# EAGLE design Placa final para testes (EAGLE 9.6.2)
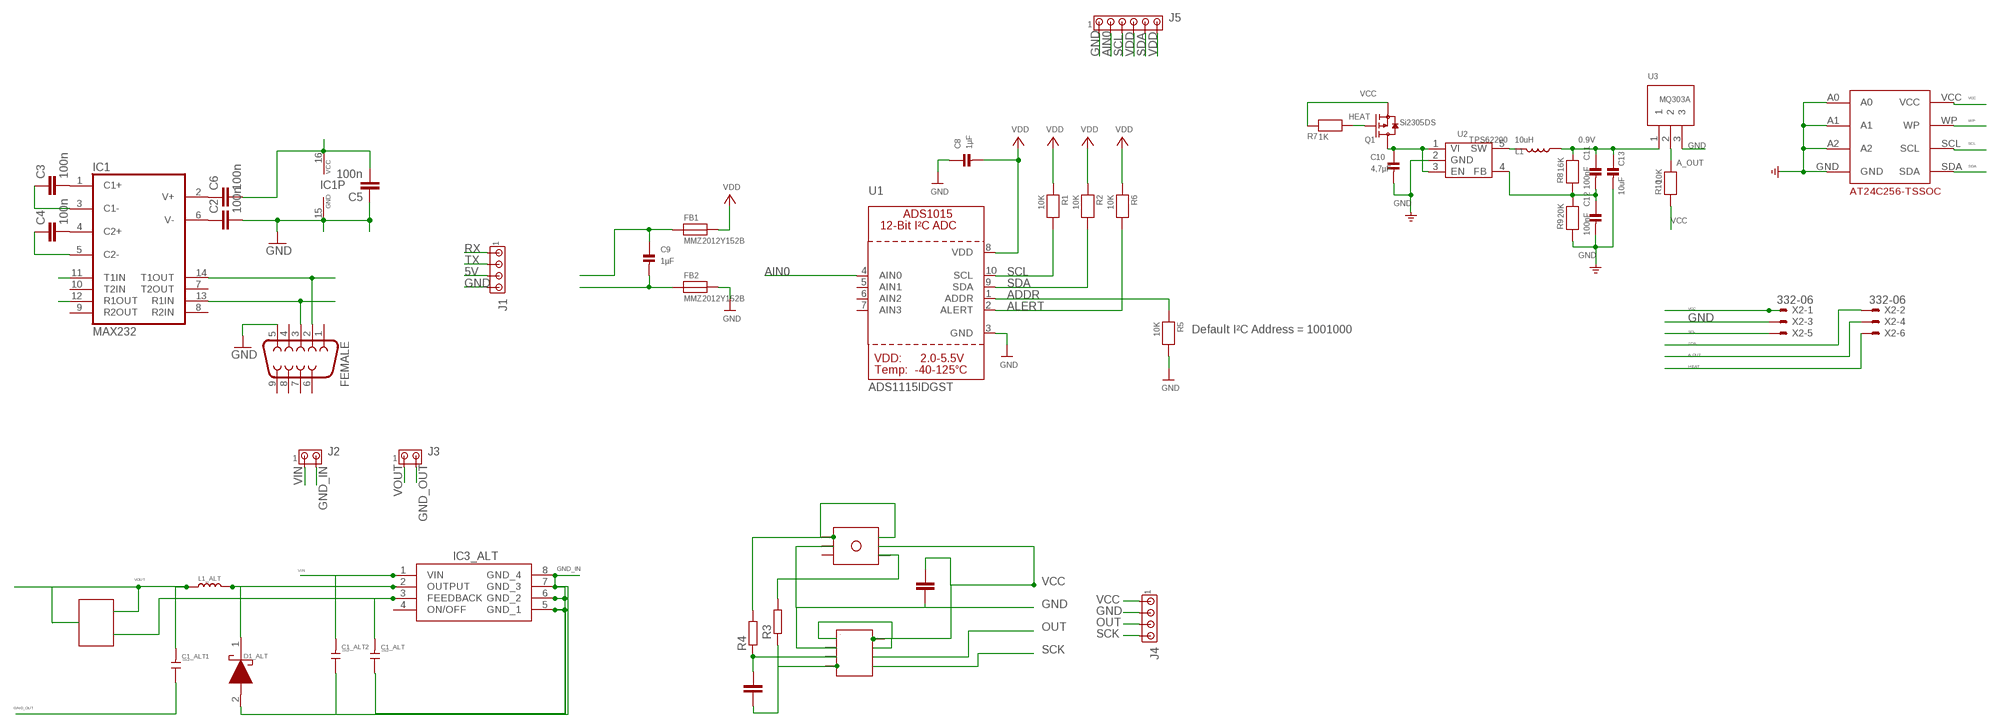
[diagram p0: schematic, sheet 1]

## Parts
C1  100n  C-EUC0805  [C0805]
C1_ALT  105uF  C-0805  [C0805]
C1_ALT1  105uF  C-0805  [C0805]
C1_ALT2  105uF  C-0805  [C0805]
C2  100n  C-EUC0805  [C0805]
C3  100n  C-EUC0805  [C0805]
C4  100n  C-EUC0805  [C0805]
C5  100n  C-EUC0805  [C0805]
C6  100n  C-EUC0805  [C0805]
C7  100n  C-EUC0805  [C0805]
C8  1µF  CAP_CERAMIC0805  [0805]
C9  1µF  CAP_CERAMIC0805  [0805]
C10  4,7µF  CAP_CERAMIC0805  [0805]
C11  100nF  CAP_CERAMIC0805  [0805]
C12  100nF  CAP_CERAMIC0805  [0805]
C13  10uF  CAP_CERAMIC0805  [0805]
D1_ALT  1N5819HW1-7-F  [SODFL3518X115N]
FB1  MMZ2012Y152B  FERRITE0805  [0805]
FB2  MMZ2012Y152B  FERRITE0805  [0805]
FEMALE  F09H  [F09H]
IC1  MAX232  MAX232ECWES  [SO16]
IC3_ALT  XL1509-3.3E1  [SOIC127P600X175-8N]
J1  MTA04-156  [1X4MTA]
J2  MTA02-156  [1X2MTA]
J3  MTA02-156  [1X2MTA]
J4  MTA04-100  [10X04MTA]
J5  MTA06-156  [1X6MTA]
L1  10uH  L'PIO73'  [PIO73]
L1_ALT  47uH  L'PIO73'  [PIO73]
Q1  Si2305DS  MOSFET-P'SI2323CDS/SI2305DS<BR>'  [SOT23]
R1  10K  RESISTOR0805  [0805]
R2  10K  RESISTOR0805  [0805]
R3  R-EU_R0805  [R0805]
R4  R-EU_R0805  [R0805]
R5  10K  RESISTOR0805  [0805]
R6  10K  RESISTOR0805  [0805]
R7  1K  RESISTOR0805  [0805]
R8  16K  RESISTOR0805  [0805]
R9  20K  RESISTOR0805  [0805]
R10  10K  RESISTOR0805  [0805]
U1  ADS1115IDGST  ADC_ADS1015  [MSOP10]
U2  TPS62200  TPS62200DBV  [SOT23-5]
U3  MQ303A  [MQ303A]
U$1  TRIMPOT  [TRIMPOT]
U$2  HX710B  [HX710B]
U$3  PRESSURE  [PRESSURE]
U$15  DECADE-AT24C256-10TI-2.7  [DECADE-AT24CXX]
X2  332-06  [332-06]

## Nets
0.9V: C11.1 C13.1 L1.2 R8.2 U3.1
5V: C5.2 C6.2 IC1.16(VCC) J1.3
A_OUT: R10.2 U3.2 X2.4
ADDR: R5.1 U1.1(ADDR)
AIN0: J5.2 U1.4(AIN0)
ALERT: R6.2 U1.2(ALERT)
GND: C2.2 C5.1 C7.2 C8.1 C10.2 C12.2 C13.2 FB2.2 FEMALE.5 IC1.15(GND) J1.4 J4.2 J5.1 R5.2 R9.1 U1.3(GND) U2.2(GND) U3.3 U$2.AGND U$3.2 U$15.A0 U$15.A1 U$15.A2 U$15.GND X2.3
GND_IN: C1_ALT2.1 C1_ALT.1 D1_ALT.2(A) IC3_ALT.5(GND_1) IC3_ALT.6(GND_2) IC3_ALT.7(GND_3) IC3_ALT.8(GND_4) J2.2
GND_OUT: C1_ALT1.1 J3.2
HEAT: Q1.1(G) R7.2 X2.6
N$1: C1.2 R4.1 U$2.INN
N$2: C1.1 R3.1 U$2.INP
N$3: D1_ALT.1(K) IC3_ALT.2(OUTPUT) L1_ALT.1
N$4: R4.2 U$3.1 U$3.6
N$5: R3.2 U$3.4
N$6: C9.2 FB2.1
N$7: C9.1 FB1.1
N$8: C1_ALT.2 IC3_ALT.3(FEEDBACK) U$1.OUT
N$9: C10.1 Q1.3(D) U2.1(VI) U2.3(EN)
N$10: C3.2 IC1.1(C1+)
N$11: L1.1 U2.5(SW)
N$12: C4.2 IC1.4(C2+)
N$13: C3.1 IC1.3(C1-)
N$14: C4.1 IC1.5(C2-)
N$15: C6.1 IC1.2(V+)
N$16: C2.1 IC1.6(V-)
N$17: C11.2 C12.1 R8.1 R9.2 U2.4(FB)
N$19: FEMALE.2 IC1.14(T1OUT)
N$20: FEMALE.3 IC1.13(R1IN)
OUT: J4.3 U$2.DOUT
RX: IC1.12(R1OUT) J1.1
SCK: J4.4 U$2.SCK
SCL: J5.3 R1.2 U1.10(SCL) U$15.SCL X2.5
SDA: J5.5 R2.2 U1.9(SDA) U$15.SDA X2.2
TX: IC1.11(T1IN) J1.2
VCC: C7.1 J4.1 Q1.2(S) R7.1 R10.1 U$2.AVDD U$2.DVDD U$2.VREF U$3.5 U$15.VCC X2.1
VDD: C8.2 FB1.2 J5.4 J5.6 R1.1 R2.1 R6.1 U1.8(VDD)
VIN: C1_ALT2.2 IC3_ALT.1(VIN) J2.1
VOUT: C1_ALT1.2 J3.1 L1_ALT.2 U$1.VCC1 U$1.VCC2
WP: U$15.WP
Unconnected: FEMALE.1 FEMALE.4 FEMALE.6 FEMALE.7 FEMALE.8 FEMALE.9 IC1.7(T2OUT) IC1.8(R2IN) IC1.9(R2OUT) IC1.10(T2IN) IC3_ALT.4(ON/OFF) U1.5(AIN1) U1.6(AIN2) U1.7(AIN3) U$3.3

## Notes on the sheet
- Default I²C Address = 1001000

## Library data of the parts
C1-C7 = rcl@1:C-EU: CAPACITOR, European symbol
C1_ALT C1_ALT1 C1_ALT2 = discrete:C*: Ceramic Capacitors
C8-C13 = microbuilder:CAP_CERAMIC: Ceramic Capacitors 0402 - 0402 Surface Mount Capacitors 16pF 50V 5% [Digikey: 445-4899-2-ND] 18pF 50V 5% [Digikey: 490-1281-2-ND] 22pF 50V 5% [Digikey: 490-1283-2-ND] 68pF 50V 5% [Digikey: 490-1289-2-ND] 0.1uF 10V 10% [Digikey: 490-1318-2-ND] 1.0uF 6.3V 10% [Digikey: 490-1320-2-ND] 0603 - 0603 Surface Mount Capacitors 16 pF 50V 5% [Digikey: 445-5051-2-ND] 22 pF 50V [Digikey: PCC220ACVTR-ND] 33 pF 50V 5% [Digikey: 490-1415-1-ND] 56pF 50V 5% [Digikey: 490-1421-1-ND] 220pF 50V 5% [Digikey: 445-1285-1-ND] 680 pF 50V 2200 pF 50V 5% C0G [Digikey: 445-1297-1-ND] 5600 pF 100V 5% X7R [Digikey: 478-3711-1-ND] 0.1 µF 25V 10% [Digikey: PCC2277TR-ND] 0.22 µF 16V 10% X7R [Digikey: 445-1318-1-ND] 1.0 µF 25V 10% [Digikey: 445-5146-2-ND] 0603 - RF Specific 3pF 250V +/-0.1pF RF [Digikey: 712-1347-1-ND] 18 pF 250V 5% [Digikey: 478-3505-1-ND or 712-1322-1-ND] 56 pF 250V 5% C0G RF [Digikey: 490-4867-1-ND] 68 pF 250V RF [Digikey: 490-4868-1-ND] 0805 - 0805 Surface Mount Capacitors 220 pF 250V 2% RF Ceramic Capacitor [Digikey: 712-1398-1-ND] 1000 pF 50V 2% NP0 Ceramic Capacitor [Digikey: 478-3760-1-ND] 0.1 µF 25V 10% Ceramic Capacitor [Digikey: PCC1828TR-ND] 1.0 µF 16V 10% Ceramic Capacitor[Digikey: 490-1691-2-ND] 10.0 µF 10V 10% Ceramic Capacitor[Digikey: 709-1228-1-ND] 10.0 uF 16V 10% Ceramic Capacitor [Digikey: 478-5165-2-ND] 47 uF 6.3V 20% Ceramic Capacitor [Digikey: 587-1779-1-ND or 399-5506-1-ND] 1206 - 1206 Surface Mount Capacitors 47uF 10V 20% Ceramic Capacitor [Digikey: 490-5528-1-ND or 399-5508-1-ND or 445-6010-1-ND] 100uF 6.3V -20%, +80% Y5V Ceramic Capacitor (Digikey: 490-4512-1-ND, Mouser: 81-GRM31CF50J107ZE1L)
D1_ALT = 1N5819HW1-7-F:1N5819HW1-7-F: 1N5819 Schottky Diode 40V 1A SOD123F Source: Datasheet <https://www.diodes.com/assets/Datasheets/1N5819HW1.pdf>; ARROW_PART_NUMBER: 1N5819HW1-7-F; ARROW_PRICE-STOCK: https://www.arrow.com/en/products/1n5819hw1-7-f/diodes-incorporated?region=nac; DESCRIPTION: 1N5819 Schottky Diode 40V 1A SOD123F; HEIGHT: 1.15mm; MANUFACTURER_NAME: Diodes Inc.; MANUFACTURER_PART_NUMBER: 1N5819HW1-7-F; MOUSER_PART_NUMBER: 621-1N5819HW1-7-F; MOUSER_PRICE-STOCK: https://www.mouser.co.uk/ProductDetail/Diodes-Incorporated/1N5819HW1-7-F?qs=60RJRzIpcl9ACQG7Zn63jQ%3D%3D
FB1 FB2 = microbuilder:FERRITE: Ferrite Bead 0603 MMZ1608B121C - 120 Ohm, 600mA Ferrite Chip - Digikey: 445-2164-1-ND BK1608HW121-T - 120 Ohm, 600mA Ferrite Chip - Digikey: 587-1876-2-ND 0805 HZ0805B272R-10 - 2.7K Ohm @ 100MHz, 200mA 0.8 Ohm DC Resistance - Digikey: 240-2504-1-ND (see also Murata BLM21BD272SN1L)
FEMALE = con-subd:F09: SUB-D
IC1 = maxim-6b:MAX232ECWE: RS232 TRANSEIVER
IC3_ALT = XL1509-3.3E1:XL1509-3.3E1: 40V 2A SOP-8_150mil DC-DC Converters RoHS Source: Datasheet <https://datasheet.lcsc.com/szlcsc/XLSEMI-XL1509-3-3E1_C74193.pdf>; DESCRIPTION: 40V 2A SOP-8_150mil DC-DC Converters RoHS; HEIGHT: 1.75mm; MANUFACTURER_NAME: XLSEMI; MANUFACTURER_PART_NUMBER: XL1509-3.3E1
J1 = con-amp:MTA04-156: AMP connector
J2 J3 = con-amp:MTA02-156: AMP connector
J4 = con-amp:MTA04-100: AMP connector
J5 = con-amp:MTA06-156: AMP connector
L1 = Discrete:L*
L1_ALT = discrete:L*
Q1 = Discrete:MOSFET-P
R1 R2 R5-R10 = microbuilder:RESISTOR: Resistors 0402 - 0402 Surface Mount Package 22 Ohm 1% 1/16W [Digikey: 311-22.0LRTR-ND] 33 Ohm 5% 1/16W 1.0K 5% 1/16W 1.5K 5% 1/16W 2.0K 1% 1/16W 10.0K 1% 1/16W [Digikey: 311-10.0KLRTR-ND] 10.0K 5% 1/16W [Digikey: RMCF0402JT10K0TR-ND] 12.1K 1% 1/16W [Digikey: 311-22.0LRTR-ND] 100.0K 5% 1/16W 0603 - 0603 Surface Mount Package 0 Ohm 1/10 Watt 1% Resistor 15 Ohm 1/10 Watt 1% Resistor 33 Ohm 1/10 Watt 1% Resistor 49.9 Ohm 1/10 Watt 1% Resistor 100 Ohm 1/10 Watt 1% Resistor 150 Ohm 1/10 Watt 1% Resistor 240 Ohm 1/10 Watt 1% Resistor 390 Ohm 1/10 Watt 1% Resistor 560 Ohm 1/10 Watt 1% Resistor 680 Ohm 1/10 Watt 1% Resistor 750 Ohm 1/10 Watt 1% Resistor 1.0K Ohm 1/10 Watt 1% Resistor 1.5K Ohm 1/10 Watt 1% Resistor 2.0K Ohm 1/10 Watt 1% Resistor 2.2K Ohm 1/10 Watt 1% Resistor 3.3K Ohm 1/10 Watt 1% Resistor 4.7K Ohm 1/10 Watt 1% Resistor 10.0K Ohm 1/10 Watt 1% Resistor 12.0K Ohm 1/10 Watt 1% Resistor 12.1K Ohm 1/10 Watt 1% Resistor 20.0K Ohm 1/10 Watt 1% Resistor 33.0K Ohm 1/10 Watt 1% Resistor 100.0K Ohm 1/10 Watt 1% Resistor 0805 - 0805 Surface Mount Package 0 Ohm 1/8 Watt 1% Resistor 33 Ohm 1/8 Watt 1% Resistor 100 Ohm 1/8 Watt 1% Resistor 150 Ohm 1/8 Watt 1% Resistor 200 Ohm 1/8 Watt 1% Resistor 240 Ohm 1/8 Watt 1% Resistor 330 Ohm 1/8 Watt 1% Resistor 390 Ohm 1/8 Watt 1% Resistor 470 Ohm 1/8 Watt 1% Resistor 1.0K Ohm 1/8 Watt 1% Resistor 1.5K Ohm 1/8 Watt 1% Resistor 2.0K Ohm 1/8 Watt 1% Resistor 4.7K Ohm 1/8 Watt 1% Resistor 5.1K Ohm 1/8 Watt 1% Resistor 5.6K Ohm 1/8 Watt 1% Resistor 10.0K Ohm 1/8 Watt 1% Resistor 22.0K Ohm 1/8 Watt 1% Resistor 33.0K Ohm 1/8 Watt 1% Resistor 100K Ohm 1/8 Watt 1% Resistor 1206 - 1206 Surface Mount Package 2012 - 2010 Surface Mount Package 0.11 Ohm 1/2 Watt 1% Resistor - Digikey: RHM.11UCT-ND
R3 R4 = rcl:R-EU_: RESISTOR, European symbol; SPICEPREFIX: R
U1 = microbuilder:ADC_ADS1015: ADS1015 - 12-bit 4-Channel I2C ADC with Internal PGA VDD: 2.0-5.5V Sampling Rate: 3.3ksps Gain Settings: 2/3, 1, 2, 4, 8, 16 I2C Address: ADDR low = 1001000x, ADDR high = 1001001x Internal Comparator The ADS1015 includes an internal comparator that can be set to output a high-level on ALERT when the conversion results exceeeds a pre-defined upper level, and will deassert itself when the level falls below a pre-defined lower threshold level. It can also be set to windowed mode where the ALERT pin will be asserted if the data exceeds the upper threshold or falls below the lower threshold.
U2 = IC:TPS62200: High-Efficiency,SOT23 STEP-DOWN,DC-DC Converter
U3 = MQ303A:MQ303A
U$1 = TRIMPOT:TRIMPOT
U$2 = HX710B:HX710B
U$3 = PRESSURE:PRESSURE
U$15 = DECADE-libraries20151104:DECADE-AT24C256-10TI-2.7
X2 = con-garry:332-06: 6 Pin - 2mm Dual Row Source: www.mpe-connector.de / garry_shortform_2012.pdf

## Board
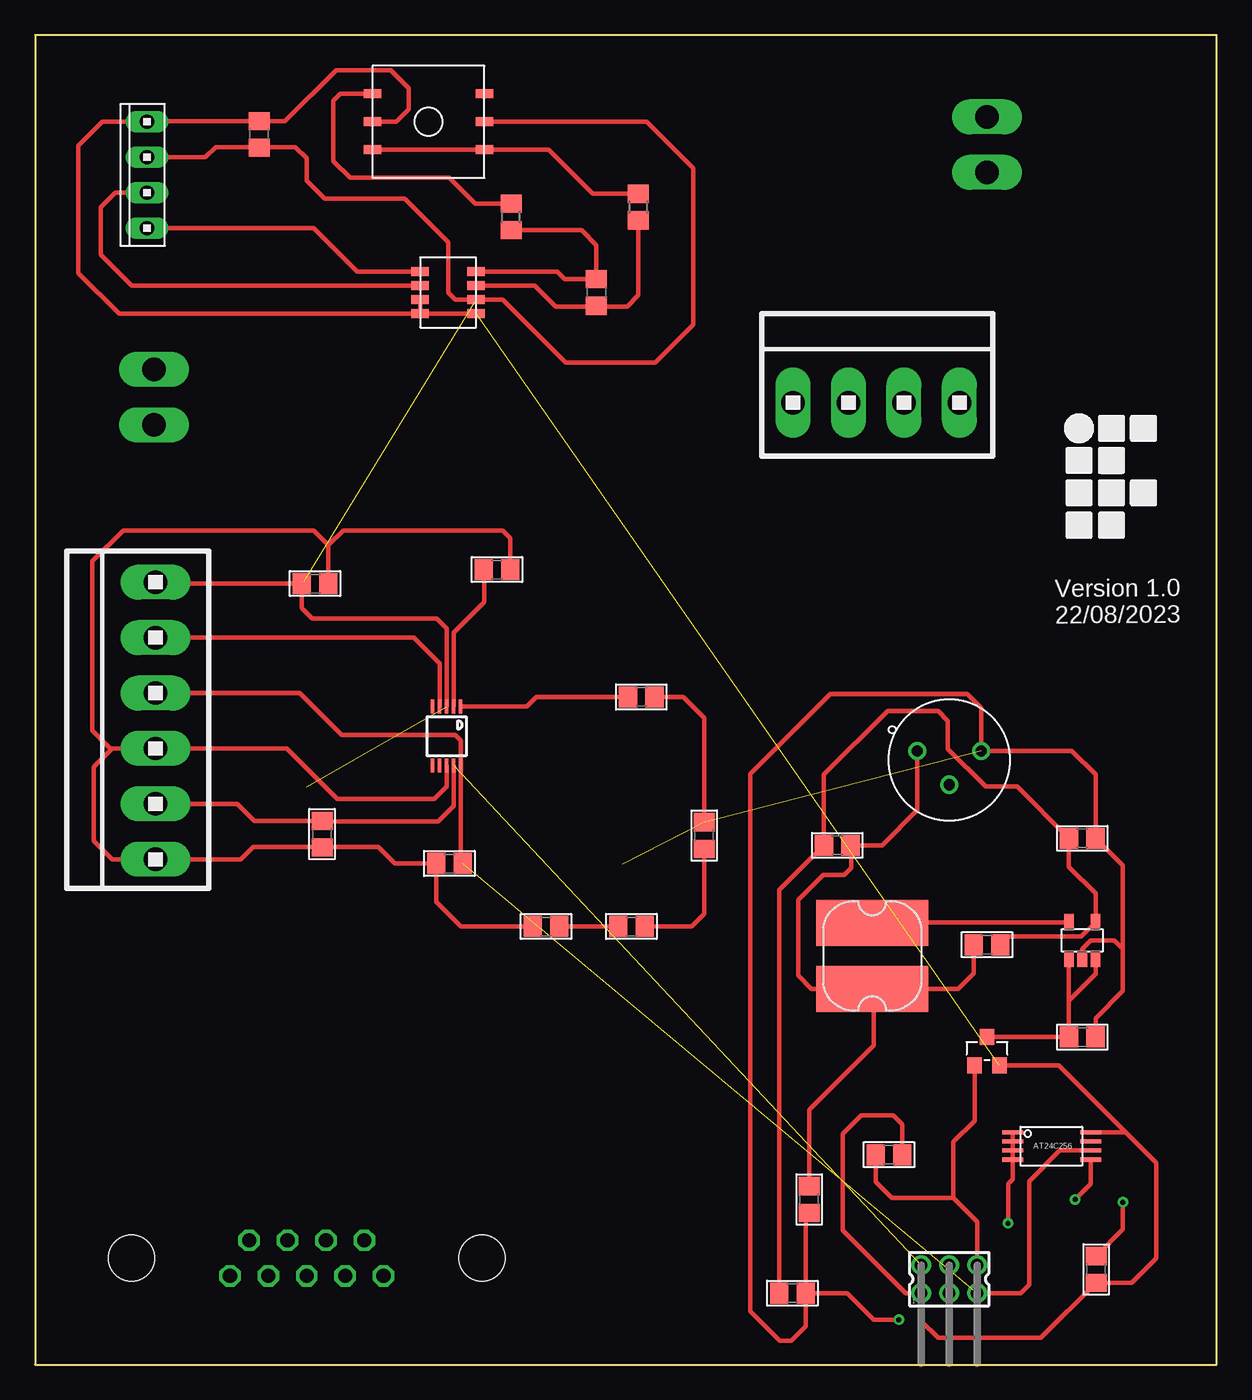
[diagram p1: board, top side]
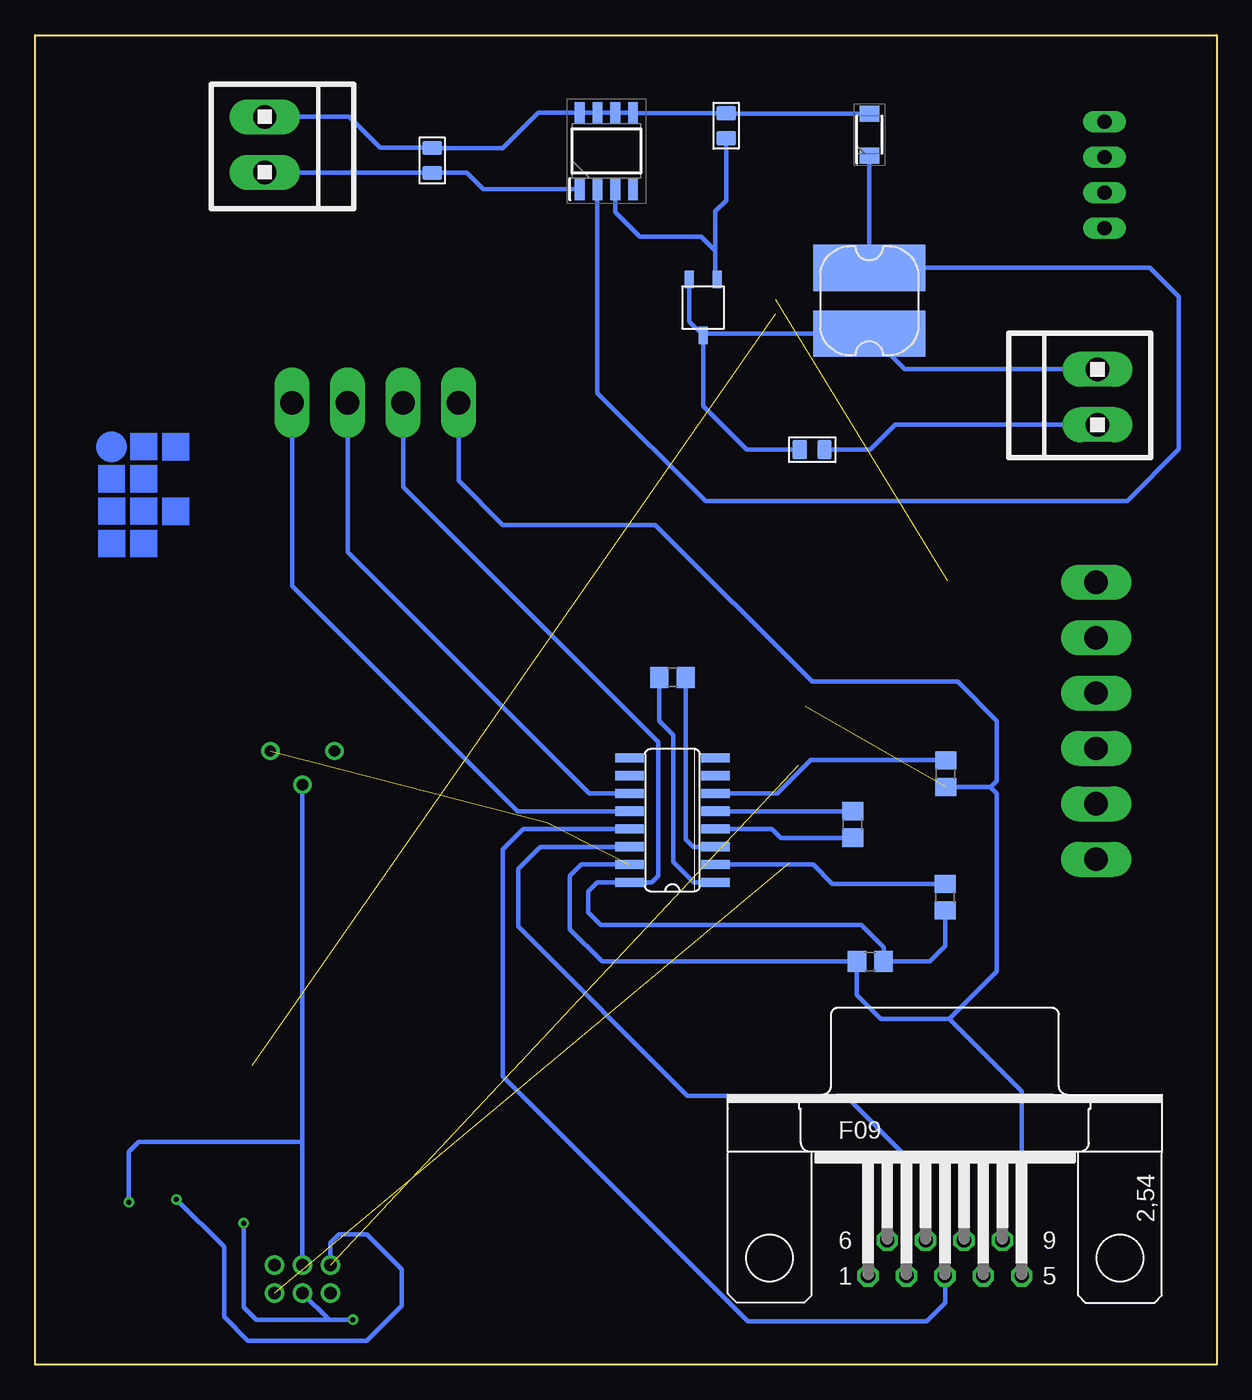
[diagram p2: board, bottom side, seen from below]

Size 84.4 x 95 mm. Coordinates in mm from the lower left corner, seen from the top.
Outline: 0,95 0,0 84.4,0 84.4,95 0,95
Copper layers (1*16): Top 0.035mm / dielectric 1.5mm / Bottom 0.035mm
Design rules "default": minimum track width 6mil, minimum drill 0.35mm, track to track 6mil, track to pad 6mil, pad to pad 6mil, via to via 6mil, smd to smd 6mil, copper to edge 40mil, drill to drill 6mil, minimum pad ring 10mil, minimum via ring 8mil, stop-mask expansion 4mil, vias tented up to drill 0mil, thermal gap 10mil

### Footprints (pad centres in the part's own frame; a part is rotated, then mirrored left to right if it is on the bottom)
C0805 = smd 1.3 x 1.5: 1 -0.95,0; 2 0.95,0
C0805' = smd 1.016 x 1.397: 1 -0.889,0; 2 0.889,0
0805 = smd 1.3 x 1.5: 1 -0.95,0; 2 0.95,0
SODFL3518X115N = smd 1.12 x 1.37: 1 -1.5,0; 2 1.5,0
F09H = drill 1.016 octagon: 1 -5.486,-1.27; 2 -2.743,-1.27; 3 0,-1.27; 4 2.743,-1.27; 5 5.486,-1.27; 6 -4.115,1.27; 7 -1.372,1.27; 8 1.372,1.27; 9 4.115,1.27 | hole 3.302: -12.522,0; 12.522,0
SO16 = smd 0.66 x 2.032: 1 -4.445,-3.073; 2 -3.175,-3.073; 3 -1.905,-3.073; 4 -0.635,-3.073; 5 0.635,-3.073; 6 1.905,-3.073; 7 3.175,-3.073; 8 4.445,-3.073; 9 4.445,3.073; 10 3.175,3.073; 11 1.905,3.073; 12 0.635,3.073; 13 -0.635,3.073; 14 -1.905,3.073; 15 -3.175,3.073; 16 -4.445,3.073
SOIC127P600X175-8N = smd 1.55 x 0.7: 1 -2.725,1.905; 2 -2.725,0.635; 3 -2.725,-0.635; 4 -2.725,-1.905; 5 2.725,-1.905; 6 2.725,-0.635; 7 2.725,0.635; 8 2.725,1.905
1X4MTA = drill 1.676 long: 1 5.944,0; 2 1.981,0; 3 -1.981,0; 4 -5.944,0
1X2MTA = drill 1.676 long: 1 1.981,0; 2 -1.981,0
10X04MTA = drill 1.016 long: 1 3.81,0; 2 1.27,0; 3 -1.27,0; 4 -3.81,0
1X6MTA = drill 1.676 long: 1 9.906,0; 2 5.944,0; 3 1.981,0; 4 -1.981,0; 5 -5.944,0; 6 -9.906,0
PIO73 = smd 8 x 3.3: 1 0,2.35; 2 0,-2.35
SOT23 = smd 1.016 x 1.143: 1 -0.889,-1.016; 2 0.889,-1.016; 3 0,1.016
R0805 = smd 1.3 x 1.5: 1 -0.95,0; 2 0.95,0
MSOP10 = smd 0.25 x 1: 1 -1,-2.113; 2 -0.5,-2.113; 3 0,-2.113; 4 0.5,-2.113; 5 1,-2.113; 6 1,2.113; 7 0.5,2.113; 8 0,2.113; 9 -0.5,2.113; 10 -1,2.113
SOT23-5 = smd 0.69 x 1.2: 1 -0.95,-1.3; 2 0,-1.3; 3 0.95,-1.3; 4 0.95,1.3; 5 -0.95,1.3
MQ303A = drill 0.8: 1 -2.286,0.635; 2 0,-1.778; 3 2.286,0.635
TRIMPOT = smd 1.27 x 0.635: OUT 0.5,0.5; VCC1 -3.5,1.5; VCC2 0.5,2.5
HX710B = smd 1.27 x 0.635: AGND -5,4; AVDD -1,5; DOUT -1,3; DVDD -1,4; INN -5,3; INP -5,2; SCK -1,2; VREF -5,5
PRESSURE = smd 1.27 x 0.635: 1 -9,7; 2 -9,5; 3 -9,3; 4 -1,3; 5 -1,5; 6 -1,7
DECADE-AT24CXX = smd 1.5 x 0.3: A0 -2.75,1; A1 -2.75,0.35; A2 -2.75,-0.3; GND -2.75,-0.95; SCL 2.8,-0.3; SDA 2.8,-0.95; VCC 2.8,1; WP 2.8,0.35
332-06 = drill 0.9 pad 1.27: 1 -2,-1; 2 -2,1; 3 0,-1; 4 0,1; 5 2,-1; 6 2,1

### Placement (x,y rotation side)
C1  40.1,76.6 270 top
C1_ALT  105uF  [C0805']  35.03,88.52 270 bottom
C1_ALT1  105uF  [C0805']  28.89,65.37 180 bottom
C1_ALT2  105uF  [C0805']  56.03,86.04 270 bottom
C2  19.36,42.22 270 bottom
C3  38.86,49.1 180 bottom
C4  26,38.59 270 bottom
C5  24.74,28.8 0 bottom
C6  19.4,33.39 270 bottom
C7  16,87.9 270 top
C8  20,55.8 0 top
C9  42.6,31.3 0 top
C10  74.8,23.4 0 top
C11  68,30 0 top
C12  54.1,5.1 0 top
C13  55.3,11.8 270 top
D1_ALT  24.79,87.88 90 bottom
FB1  36.5,31.3 180 top
FB2  47.8,37.8 90 top
FEMALE  19.41,7.6 0 bottom
IC1  38.87,38.9 90 bottom
IC3_ALT  43.59,86.71 90 bottom
J1  60.09,68.73 0 top
J2  67.99,87.17 270 bottom
J3  8.5,69.13 90 bottom
J4  8,85 90 top
J5  8.6,46 90 top
L1  59.8,29.2 0 top
L1_ALT  24.81,76.01 0 bottom
Q1  68,22.4 0 top
R1  29.6,35.8 0 top
R2  20.5,37.9 90 top
R3  34,82 90 top
R4  43.1,82.7 90 top
R5  43.3,47.7 0 top
R6  33,56.8 180 top
R7  61,15 180 top
R8  57.3,37.1 0 top
R9  74.8,37.6 180 top
R10  75.8,6.8 90 top
U1  29.4,44.9 180 top
U2  74.8,30.3 0 top
U3  65.3,43.2 0 top
U$1  35.17,77.03 90 bottom
U$2  26.5,80.1 180 top
U$3  23.1,93.8 180 top
U$15  72.6,15.6 0 top
X2  65.3,6.1 0 top

### Tracks (layer width: path | path; a pad name or v marks a point on that pad's centre or on a via)
0.9V
  Top 0.305: C13.1 55.3,18.2 59.9,22.8 59.9,26.75 L1.2 | R8.2 58.3,37.1 | 58.3,37.1 60.5,37.1 63.01,39.61 U3.1 | C11.1 67.05,27.95 65.95,26.85 L1.2 | L1.2 55.45,26.85 54.5,27.8 54.5,33.2 56.3,35 57.8,35 58.3,35.5 58.3,37.1
5V
  Bottom 0.152: J1.3
  Bottom 0.305: C6.2 19.4,29.9 20.5,28.8 C5.2 23.79,29.79 25.4,31.4 44,31.4 44.9,32.3 44.9,33.8 44.24,34.45 IC1.16 40.34,34.45 39.9,34.9 39.9,44.5 58.11,62.71 J1.3
A_OUT  (via drill 0.35)
  Top 0.305: R10.2 77.7,9.65 v77.7,11.6
  Bottom 0.305: U3.2 65.3,15.9 | 65.3,15.9 X2.4 | v77.7,11.6 77.7,15.2 77,15.9 65.3,15.9
ADDR
  Top 0.305: U1.1 35.11,47.01 35.8,47.7 R5.1
AIN0
  Top 0.305: U1.4 28.9,50.1 27.06,51.94 J5.2
ALERT
  Top 0.305: U1.2 29.9,52.3 32.1,54.5 32.1,56.75 R6.2
GND  (via drill 0.35)  (4 unrouted)
  Top 0.305: J4.2 12.17,86.27 12.9,87 15.95,87 | 15.95,87 C7.2 | 15.95,87 18.6,87 19.4,86.2 19.4,84.6 20.7,83.3 26.4,83.3 29.5,80.2 29.5,76.6 30,76.1 U$2.AGND 33.4,76.1 37.9,71.6 44.3,71.6 47,74.3 47,85.5 43.7,88.8 U$3.2 | 19.22,55.97 C8.1 | C8.1 8.71,55.8 J5.1 | C8.1 19.05,54.05 19.8,53.3 28.7,53.3 29.4,52.6 U1.3 | R5.2 46.3,47.7 47.8,46.2 FB2.2 | C10.2 75.75,24.75 77.7,26.7 77.7,29.7 | 77.7,29.7 77.1,30.3 75.4,30.3 74.8,29.7 U2.2 | C12.2 55.05,10.6 C13.2 | v61.7,3.2 59.9,3.2 58,5.1 C12.2 | v69.5,10.1 69.5,12.9 69.85,13.25 U$15.GND U$15.A2 U$15.A1 U$15.A0 | U3.3 | U3.3 74.06,43.83 75.75,42.15 R9.1 77.7,35.65 77.7,29.7 | C12.2 55.05,2.75 54,1.7 53.2,1.7 51.1,3.8 51.1,42.2 56.8,47.9 66.6,47.9 67.6,46.9 U3.3
  Bottom 0.152: C5.1 | 16.13,41.27 16.17,41.27
  Bottom 0.305: IC1.15 45.38,35.73 46.2,34.9 46.2,31.1 43.9,28.8 C5.1 | C2.2 16.17,41.27 15.7,40.8 15.7,28.1 19.1,24.7 | 19.1,24.7 24,24.7 25.7,26.4 C5.1 | 16.13,41.27 15.7,41.7 15.7,46 18.5,48.8 28.9,48.8 40.1,60 51,60 54.15,63.15 J1.4 | FEMALE.5 13.92,19.52 19.1,24.7 | X2.3 63.4,3.2 | v61.7,3.2 63.4,3.2 | 63.4,3.2 68.6,3.2 69.5,4.1 v69.5,10.1
GND_IN
  Bottom 0.152: C1_ALT.1 35.4,89.41 35.37,89.38 | 41.66,89.41 IC3_ALT.5 | 56,86.9 C1_ALT2.1
  Bottom 0.305: 35.4,89.41 41.66,89.41 | 56,86.9 51,86.9 48.47,89.44 IC3_ALT.8 IC3_ALT.7 IC3_ALT.6 IC3_ALT.5 | C1_ALT2.1 59.73,86.93 61.95,89.15 J2.2 | D1_ALT.2 35.37,89.38
GND_OUT
  Bottom 0.305: C1_ALT1.1 24.73,65.37 22.95,67.15 J3.2
HEAT
  Top 0.305: R7.2 60.05,13.05 61.2,11.9 65.6,11.9 | 65.6,11.9 67.3,10.2 X2.6 | 65.6,11.9 65.6,15.9 67.11,17.41 Q1.1
N$1
  Top 0.305: U$2.INN 35.7,77.1 37.2,75.6 40.05,75.6 | 40.05,75.6 C1.2 | R4.1 43.1,76.4 42.3,75.6 40.05,75.6
N$2
  Top 0.305: U$2.INP 37.3,78.1 37.85,77.55 C1.1 40.1,80 39.05,81.05 R3.1
N$3
  Bottom 0.152: 24.81,86.36 D1_ALT.1
  Bottom 0.305: 24.81,86.36 L1_ALT.1 4.76,78.36 2.7,76.3 2.7,65.4 6.4,61.7 36.5,61.7 44.23,69.42 IC3_ALT.2
N$4
  Top 0.305: U$3.6 U$3.1 36.7,86.8 39.85,83.65 R4.2
N$5
  Top 0.305: U$3.4 21.8,90.8 21.3,90.3 21.3,86 22.5,84.8 29.6,84.8 31.45,82.95 R3.2
N$6
  Top 0.305: FB2.1 47.8,32.2 46.9,31.3 C9.2
N$7
  Top 0.305: C9.1 FB1.1
N$8
  Bottom 0.152: 35.8,77.66 U$1.OUT
  Bottom 0.305: C1_ALT.2 35.03,83.17 35.8,82.4 35.8,79.6 | 35.8,79.6 35.8,77.66 | IC3_ALT.3 42.95,82.36 41.2,80.6 36.8,80.6 35.8,79.6
N$9
  Top 0.305: Q1.3 73.83,23.42 | 73.83,23.42 C10.1 | U2.1 73.85,26 | 73.85,26 73.85,23.43 73.83,23.42 | U2.3 75.75,27.9 73.85,26
N$10
  Bottom 0.305: C3.2 39.81,46 38.81,45 38.81,35.91 37.36,34.45 IC1.1
N$11
  Top 0.305: U2.5 59.85,31.6 L1.1
N$12
  Bottom 0.305: C4.2 31.14,37.64 31.77,38.27 IC1.4
N$13
  Bottom 0.305: C3.1 37.91,37.51 37.39,36.99 IC1.3
N$14
  Bottom 0.152: C4.1
  Bottom 0.305: IC1.5 C4.1
N$15
  Bottom 0.305: C6.1 27.44,34.34 28.82,35.73 IC1.2
N$16
  Bottom 0.152: 19.39,43.2 C2.1
  Bottom 0.305: IC1.6 31.39,40.81 29,43.2 19.39,43.2
N$17
  Top 0.305: C12.1 53.15,33.9 R8.1 56.35,42.15 60.9,46.7 64.5,46.7 65.2,46 65.2,44 67.9,41.3 70.15,41.3 R9.2 73.85,35.55 75.75,33.65 U2.4 74.75,30.6 69.55,30.6 C11.2
N$19
  Bottom 0.305: IC1.14 48.3,36.99 49.9,35.4 49.9,31.3 37.8,19.2 26.5,19.2 22.15,14.85 FEMALE.2
N$20
  Bottom 0.305: IC1.13 49.53,38.27 51,36.8 51,20.6 33.5,3.1 20.7,3.1 19.4,4.4 FEMALE.3
OUT
  Top 0.305: U$2.DOUT 6.9,77.1 4.7,79.3 4.7,82.7 5.73,83.73 J4.3
RX
  Bottom 0.305: IC1.12 49.94,39.53 66.03,55.63 J1.1
SCK
  Top 0.305: J4.4 19.91,81.19 23,78.1 U$2.SCK
SCL  (1 unrouted)
  Top 0.305: J5.3 8.62,48 18.9,48 21.9,45 30,45 30.4,44.6 U1.10 30.4,35.95 R1.2 | U$15.SCL 73.2,15.3 71,13.1 71,5.7 70.4,5.1 X2.5
SDA  (via drill 0.35)  (1 unrouted)
  Top 0.305: J5.5 14.44,40.06 15.65,38.85 R2.2 20.55,38.8 28.8,38.8 29.9,39.9 U1.9 | U$15.SDA 75.4,12.9 v74.3,11.8
  Bottom 0.305: v74.3,11.8 70.9,8.4 70.9,3.4 69.2,1.7 60.7,1.7 58.2,4.2 58.2,6.8 60.7,9.3 62.7,9.3 63.3,8.7 X2.2
TX
  Bottom 0.305: 42.8,40.81 IC1.11 44.8,40.81 62.07,58.07 J1.2
VCC  (1 unrouted)
  Top 0.305: 24.05,88.85 U$3.5 25.8,88.8 26.7,89.7 26.7,91.2 25.4,92.5 21.5,92.5 17.85,88.85 C7.1 8.04,88.85 J4.1 4.81,88.81 3.1,87.1 3.1,78 6,75.1 U$2.AVDD | U$2.VREF U$2.AVDD | U$2.AVDD U$2.DVDD | R7.1 61.95,17.15 61.3,17.8 59,17.8 57.7,16.5 57.7,9.6 62.2,5.1 X2.1 63.3,3.1 64.5,1.9 71.85,1.9 R10.1 78.35,5.85 80.1,7.6 80.1,14.4 77.9,16.6 | 77.9,16.6 U$15.VCC | 77.9,16.6 73.12,21.38 Q1.2
VDD
  Top 0.305: U1.8 29.4,41.3 28.5,40.4 21.6,40.4 17.98,44.02 J5.4 5.52,44.02 | 5.52,44.02 4.2,42.7 4.2,37.4 5.51,36.09 J5.6 14.69,36.09 15.6,37 20.45,37 R2.1 20.55,37 24.5,37 25.7,35.8 R1.1 28.65,33.05 30.4,31.3 FB1.2 | C8.2 20.95,58.55 | 20.95,58.55 19.9,59.6 6.3,59.6 4.1,57.4 4.1,45.3 5.38,44.02 5.52,44.02 | R6.1 33.95,59.05 33.4,59.6 22,59.6 20.95,58.55
VIN
  Bottom 0.152: J2.1 67.95,85.15
  Bottom 0.305: 67.95,85.15 C1_ALT2.2 53.55,85.15 52.38,83.98 IC3_ALT.1
VOUT
  Bottom 0.152: U$1.VCC1 36.72,73.58 36.64,73.66
  Bottom 0.305: U$1.VCC2 37.67,74.53 36.72,73.58 | U$1.VCC1 36.67,68.47 33.57,65.37 C1_ALT1.2 | J3.1 22.26,71.11 L1_ALT.2 36.64,73.66
(copper drawn outside any net)
  shapes: Bottom area x9, Bottom circle x3

### Text on the board
tNames: Version 1.0 / 22/08/2023